# Altium schematic sheet SCH_BBQ20_USB_Keyboard.schdoc
size 432 x 302 mm
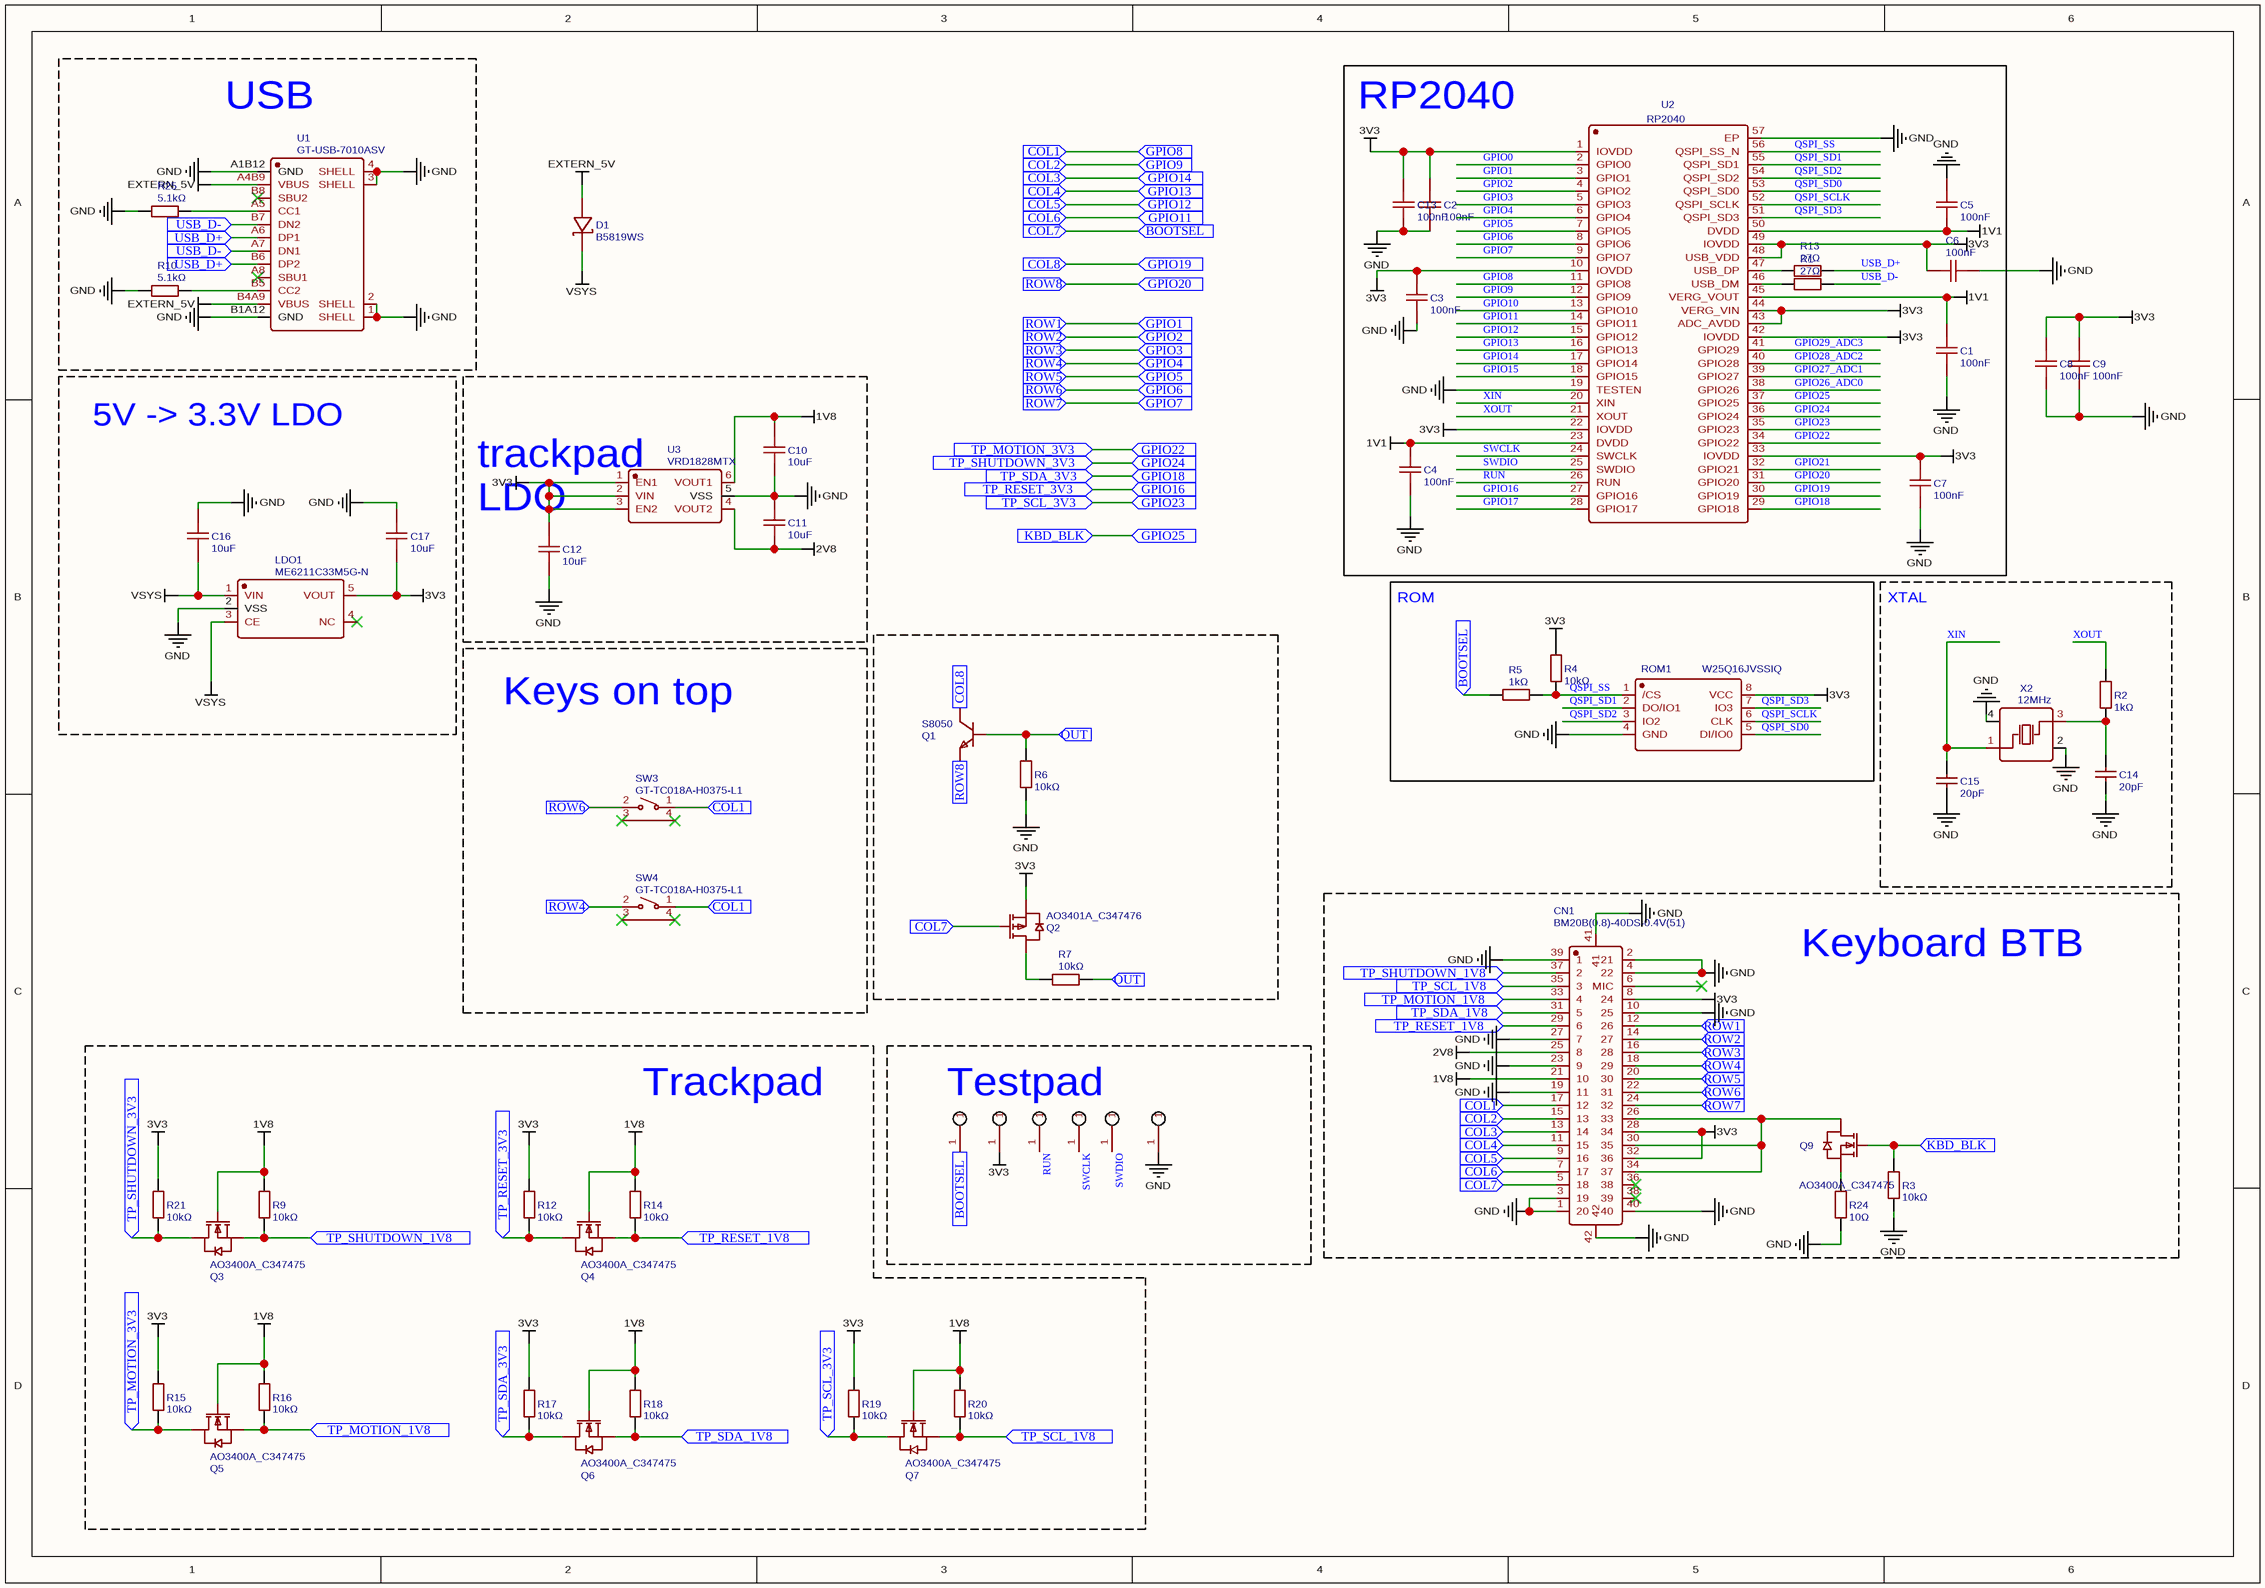
[diagram p0: SCH_BBQ20_USB_Keyboard.schdoc]

## Parts
C1  100nF  [C0603]
C2  100nF  [C0603]
C3  100nF  [C0603]
C4  100nF  [C0603]
C5  100nF  [C0603]
C6  100nF  [C0603]
C7  100nF  [C0603]
C8  100nF  [C0603]
C9  100nF  [C0603]
C10  10uF  [C0603]
C11  10uF  [C0603]
C12  10uF  [C0603]
C13  100nF  [C0603]
C14  20pF  [C0603]
C15  20pF  [C0603]
C16  10uF  [C0603]
C17  10uF  [C0603]
CN1  BM20B(0.8)-40DS-0.4V(51)  [CONN-SMD_BM20B-0.8-40DS-0.4V-51]
D1  B5819WS  [SOD-323_L1.8-W1.3-LS2.5-RD]
LDO1  ME6211C33M5G-N  [SOT-23-5_L3.0-W1.7-P0.95-LS2.8-BL]
Q1  S8050  [SOT-23-3_L2.9-W1.3-P1.90-LS2.4-BR]
Q2  AO3401A_C347476  [SOT-23_L2.9-W1.3-P1.90-LS2.4-BR]
Q3  AO3400A_C347475  [SOT-23-3_L2.9-W1.3-P1.90-LS2.4-BR]
Q4  AO3400A_C347475  [SOT-23-3_L2.9-W1.3-P1.90-LS2.4-BR]
Q5  AO3400A_C347475  [SOT-23-3_L2.9-W1.3-P1.90-LS2.4-BR]
Q6  AO3400A_C347475  [SOT-23-3_L2.9-W1.3-P1.90-LS2.4-BR]
Q7  AO3400A_C347475  [SOT-23-3_L2.9-W1.3-P1.90-LS2.4-BR]
Q9  AO3400A_C347475  [SOT-23-3_L2.9-W1.3-P1.90-LS2.4-BR]
R1  27Ω  [R0603]
R2  1kΩ  [R0603]
R3  10kΩ  [R0603]
R4  10kΩ  [R0603]
R5  1kΩ  [R0603]
R6  10kΩ  [R0603]
R7  10kΩ  [R0603]
R9  10kΩ  [R0603]
R10  5.1kΩ  [R0603]
R12  10kΩ  [R0603]
R13  27Ω  [R0603]
R14  10kΩ  [R0603]
R15  10kΩ  [R0603]
R16  10kΩ  [R0603]
R17  10kΩ  [R0603]
R18  10kΩ  [R0603]
R19  10kΩ  [R0603]
R20  10kΩ  [R0603]
R21  10kΩ  [R0603]
R24  10Ω  [R0603]
R25  5.1kΩ  [R0603]
ROM1  W25Q16JVSSIQ  [SOIC-8_L5.3-W5.3-P1.27-LS8.0-BL]
SW3  GT-TC018A-H0375-L1  [SW-SMD_L4.7-W3.5-P3.35-EH]
SW4  GT-TC018A-H0375-L1  [SW-SMD_L4.7-W3.5-P3.35-EH]
U1  GT-USB-7010ASV  [USB-C-SMD_G-SWITCH_GT-USB-7010ASV]
U2  RP2040  [QFN-56_L7.0-W7.0-P0.90-TL-EP3.2]
U3  VRD1828MTX  [SOT-23-6_L2.9-W1.6-P0.95-LS2.8-BL]
U5  NO  [测试焊盘]  (value not drawn)
U6  NO  [测试焊盘]  (value not drawn)
U7  NO  [测试焊盘]  (value not drawn)
U8  NO  [测试焊盘]  (value not drawn)
U9  NO  [测试焊盘]  (value not drawn)
U10  NO  [测试焊盘]  (value not drawn)
X2  12MHz  [CRYSTAL-SMD_4P-L3.2-W2.5-BL]

## Blocks framed on the sheet
USB: R10 R25 U1
RP2040: C1-C7 C13 R1 R13 U2
5V -> 3.3V LDO: C16 C17 LDO1
ROM: R4 R5 ROM1
XTAL: C14 C15 R2 X2
Keys on top: SW3 SW4
Keyboard BTB: CN1 Q9 R3 R24
Trackpad: Q3-Q7 R9 R12 R14-R21
Testpad: U5-U10

## Ports
BOOTSEL (in), COL1 (in), COL2 (in), COL3 (in), COL4 (in), COL5 (in), COL6 (in), COL7 (in), COL8 (in), GPIO1 (in), GPIO2 (in), GPIO3 (in), GPIO4 (in), GPIO5 (in), GPIO6 (in), GPIO7 (in), GPIO8 (in), GPIO9 (in), GPIO11 (in), GPIO12 (in), GPIO13 (in), GPIO14 (in), GPIO16 (in), GPIO18 (in), GPIO19 (in), GPIO20 (in), GPIO22 (in), GPIO23 (in), GPIO24 (in), GPIO25 (in), KBD_BLK (in), OUT (in), ROW1 (in), ROW2 (in), ROW3 (in), ROW4 (in), ROW5 (in), ROW6 (in), ROW7 (in), ROW8 (in), TP_MOTION_1V8 (in), TP_MOTION_3V3 (in), TP_RESET_1V8 (in), TP_RESET_3V3 (in), TP_SCL_1V8 (in), TP_SCL_3V3 (in), TP_SDA_1V8 (in), TP_SDA_3V3 (in), TP_SHUTDOWN_1V8 (in), TP_SHUTDOWN_3V3 (in), USB_D+ (in), USB_D- (in)

## Nets
1V1: C1.2 C4.2 C5.1 U2.23(DVDD) U2.45(VERG_VOUT) U2.50(DVDD)
1V8: C10.2 CN1.21(10) Q3.1(G) Q4.1(G) Q5.1(G) Q6.1(G) Q7.1(G) R9.2 R14.2 R16.2 R18.2 R20.2 U3.6(VOUT1)
2V8: C11.1 CN1.25(8) U3.4(VOUT2)
3V3: C2.2 C3.2 C6.2 C7.2 C8.2 C9.2 C12.2 C13.2 C17.1 CN1.8(24) CN1.28(34) CN1.32(36) LDO1.5(VOUT) Q2.2(S) R4.2 R12.2 R15.2 R17.2 R19.2 R21.2 ROM1.8(VCC) U2.1(IOVDD) U2.10(IOVDD) U2.22(IOVDD) U2.33(IOVDD) U2.42(IOVDD) U2.43(ADC_AVDD) U2.44(VERG_VIN) U2.48(USB_VDD) U2.49(IOVDD) U3.1(EN1) U3.2(VIN) U3.3(EN2) U6.1
EXTERN_5V: D1.2(A) U1.A4B9(VBUS) U1.B4A9(VBUS)
GND: C1.1 C2.1 C3.1 C4.1 C5.2 C6.1 C7.1 C8.1 C9.1 C10.1 C11.2 C12.1 C13.1 C14.1 C15.1 C16.2 C17.2 CN1.1(20) CN1.2(21) CN1.3(19) CN1.4(22) CN1.10(25) CN1.19(11) CN1.23(9) CN1.27(7) CN1.39(1) CN1.40 CN1.41 CN1.42 LDO1.2(VSS) R3.1 R6.1 R10.1 R24.1 R25.1 ROM1.4(GND) U1.1(SHELL) U1.2(SHELL) U1.3(SHELL) U1.4(SHELL) U1.A1B12(GND) U1.B1A12(GND) U2.19(TESTEN) U2.57(EP) U3.5(VSS) U10.1 X2.2(GND) X2.4(GND)
VSYS: C16.1 D1.1(K) LDO1.1(VIN) LDO1.3(CE)
BOOTSEL: CN1.5(18) Q2.1(G) R5.2 U5.1 ; port COL7, port BOOTSEL
COL1: CN1.17(12) SW3.1 SW4.1 ; port COL1, port GPIO8
COL2: CN1.15(13) ; port COL2, port GPIO9
COL3: CN1.13(14) ; port COL3, port GPIO14
COL4: CN1.11(15) ; port COL4, port GPIO13
COL5: CN1.9(16) ; port COL5, port GPIO12
COL6: CN1.7(17) ; port COL6, port GPIO11
COL8: Q1.3(C) ; port COL8, port GPIO19
GPIO0: U2.2(GPIO0)
GPIO1: CN1.12(26) ; port ROW1, port GPIO1
GPIO1: U2.3(GPIO1)  [a separate net that carries the same name]
GPIO2: CN1.14(27) ; port ROW2, port GPIO2
GPIO2: U2.4(GPIO2)  [a separate net that carries the same name]
GPIO3: CN1.16(28) ; port ROW3, port GPIO3
GPIO3: U2.5(GPIO3)  [a separate net that carries the same name]
GPIO4: CN1.18(29) SW4.2 ; port ROW4, port GPIO4
GPIO4: U2.6(GPIO4)  [a separate net that carries the same name]
GPIO5: CN1.20(30) ; port ROW5, port GPIO5
GPIO5: U2.7(GPIO5)  [a separate net that carries the same name]
GPIO6: CN1.22(31) SW3.2 ; port ROW6, port GPIO6
GPIO6: U2.8(GPIO6)  [a separate net that carries the same name]
GPIO7: CN1.24(32) ; port ROW7, port GPIO7
GPIO7: U2.9(GPIO7)  [a separate net that carries the same name]
GPIO8: U2.11(GPIO8)
GPIO9: U2.12(GPIO9)
GPIO10: U2.13(GPIO10)
GPIO11: U2.14(GPIO11)
GPIO12: U2.15(GPIO12)
GPIO13: U2.16(GPIO13)
GPIO14: U2.17(GPIO14)
GPIO15: U2.18(GPIO15)
GPIO16: U2.27(GPIO16)
GPIO16: Q4.3(D) R12.1 ; port GPIO16, port TP_RESET_3V3  [a separate net that carries the same name]
GPIO17: U2.28(GPIO17)
GPIO18: U2.29(GPIO18)
GPIO18: Q6.3(D) R17.1 ; port GPIO18, port TP_SDA_3V3  [a separate net that carries the same name]
GPIO19: U2.30(GPIO19)
GPIO20: U2.31(GPIO20)
GPIO20: Q1.2(E) ; port ROW8, port GPIO20  [a separate net that carries the same name]
GPIO21: U2.32(GPIO21)
GPIO22: U2.34(GPIO22)
GPIO22: Q5.3(D) R15.1 ; port GPIO22, port TP_MOTION_3V3  [a separate net that carries the same name]
GPIO23: U2.35(GPIO23)
GPIO23: Q7.3(D) R19.1 ; port GPIO23, port TP_SCL_3V3  [a separate net that carries the same name]
GPIO24: U2.36(GPIO24)
GPIO24: Q3.3(D) R21.1 ; port GPIO24, port TP_SHUTDOWN_3V3  [a separate net that carries the same name]
GPIO25: U2.37(GPIO25)
GPIO25: Q9.1(G) R3.2 ; port KBD_BLK, port GPIO25  [a separate net that carries the same name]
GPIO26_ADC0: U2.38(GPIO26)
GPIO27_ADC1: U2.39(GPIO27)
GPIO28_ADC2: U2.40(GPIO28)
GPIO29_ADC3: U2.41(GPIO29)
OUT: Q1.1(B) R6.2 R7.2 ; port OUT
QSPI_SCLK: ROM1.6(CLK) U2.52(QSPI_SCLK)
QSPI_SD0: ROM1.5(DI/IO0) U2.53(QSPI_SD0)
QSPI_SD1: ROM1.2(DO/IO1) U2.55(QSPI_SD1)
QSPI_SD2: ROM1.3(IO2) U2.54(QSPI_SD2)
QSPI_SD3: ROM1.7(IO3) U2.51(QSPI_SD3)
QSPI_SS: R4.1 R5.1 ROM1.1(/CS) U2.56(QSPI_SS_N)
RUN: U2.26(RUN) U7.1
SWCLK: U2.24(SWCLK) U8.1
SWDIO: U2.25(SWDIO) U9.1
TP_MOTION_1V8: CN1.33(4) Q5.2(S) R16.1 ; port TP_MOTION_1V8
TP_RESET_1V8: CN1.29(6) Q4.2(S) R14.1 ; port TP_RESET_1V8
TP_SCL_1V8: CN1.35(3) Q7.2(S) R20.1 ; port TP_SCL_1V8
TP_SDA_1V8: CN1.31(5) Q6.2(S) R18.1 ; port TP_SDA_1V8
TP_SHUTDOWN_1V8: CN1.37(2) Q3.2(S) R9.1 ; port TP_SHUTDOWN_1V8
USB_D+: U1.A6(DP1) U1.B6(DP2) ; port USB_D+
USB_D+: R13.2  [a separate net that carries the same name]
USB_D-: U1.A7(DN1) U1.B7(DN2) ; port USB_D-
USB_D-: R1.2  [a separate net that carries the same name]
XIN: C15.2 U2.20(XIN) X2.1(OSC1)
XOUT: R2.2 U2.21(XOUT)
NetC14_2: C14.2 R2.1 X2.3(OSC2)
NetCN1_26: CN1.26(33) CN1.30(35) CN1.34(37) Q9.3(D)
NetQ2_3: Q2.3(D) R7.1
NetQ9_2: Q9.2(S) R24.2
NetR1_1: R1.1 U2.46(USB_DM)
NetR10_2: R10.2 U1.B5(CC2)
NetR13_1: R13.1 U2.47(USB_DP)
NetR25_2: R25.2 U1.A5(CC1)

Not connected (* = marked no-connect by the designer): CN1 6(MIC)* 36(38)* 38(39)*; LDO1 4(NC)*; SW3 3* 4*; SW4 3* 4*; U1 A8(SBU1)* B8(SBU2)*

## Notes on the sheet
- (near C12) trackpad
  LDO

## Library data of the parts
C1-C9 C13 = 100nF: Manufacturer: YAGEO(国巨); Manufacturer Part: CC0603KRX7R9BB104; nameAlias: Value; Supplier: LCSC; Supplier Part: C14663; JLCPCB Part Class: Basic Part; link: https://so.szlcsc.com/global.html?k=C14663&ref=editor; spicePre: C; spiceSymbolName: CC0603KRX7R9BB104
C10-C12 C16 C17 = 10uF: Manufacturer: SAMSUNG(三星); Manufacturer Part: CL10A106KP8NNNC; nameAlias: Value; Supplier: LCSC; Supplier Part: C19702; JLCPCB Part Class: Basic Part; link: https://so.szlcsc.com/global.html?k=C19702&ref=editor; spicePre: C; spiceSymbolName: CL10A106KP8NNNC
C14 C15 = 20pF: Manufacturer: YAGEO(国巨); Manufacturer Part: CC0603JRNPO9BN200; nameAlias: Value; Supplier: LCSC; Supplier Part: C105621; JLCPCB Part Class: Extended Part; link: https://so.szlcsc.com/global.html?k=C105621&ref=editor; spicePre: C; spiceSymbolName: CC0603JRNPO9BN200
CN1 = BM20B(0.8)-40DS-0.4V(51): Manufacturer: HRS(广濑); Contributor: LCSC; Supplier: LCSC; Supplier Part: C424543; Manufacturer Part: BM20B(0.8)-40DS-0.4V(51); JLCPCB Part Class: Extended Part; spicePre: C; spiceSymbolName: BM20B(0.8)-40DS-0.4V(51)
D1 = B5819WS: Manufacturer: MDD; Supplier: LCSC; Manufacturer Part: B5819WS; Supplier Part: C64886; JLCPCB Part Class: Extended Part; link: https://so.szlcsc.com/global.html?k=C64886&ref=editor; spicePre: D; spiceSymbolName: B5819WS
LDO1 = ME6211C33M5G-N: Manufacturer: MICRONE(南京微盟); Supplier: LCSC; Manufacturer Part: ME6211C33M5G-N; Supplier Part: C82942; JLCPCB Part Class: Extended Part; link: https://so.szlcsc.com/global.html?k=C82942&ref=editor; spicePre: L; spiceSymbolName: ME6211C33M5G-N
Q1 = S8050: Manufacturer: JSMSEMI; Contributor: LCSC; Supplier: LCSC; Supplier Part: C916390; Manufacturer Part: S8050; JLCPCB Part Class: Extended Part; spicePre: Q; spiceSymbolName: S8050
Q2 = AO3401A_C347476: Manufacturer: UMW(广东友台半导体); Contributor: LCSC; Supplier: LCSC; Supplier Part: C347476; Manufacturer Part: AO3401A; JLCPCB Part Class: Extended Part; link: https://so.szlcsc.com/global.html?k=C347476&ref=editor; spicePre: Q; spiceSymbolName: AO3401A_C347476
Q3-Q7 Q9 = AO3400A_C347475: Manufacturer: UMW(广东友台半导体); Contributor: LCSC; Supplier: LCSC; Supplier Part: C347475; Manufacturer Part: AO3400A; JLCPCB Part Class: Extended Part; link: https://so.szlcsc.com/global.html?k=C347475&ref=editor; spicePre: Q; spiceSymbolName: AO3400A_C347475
R1 R13 = 27Ω: Manufacturer: UNI-ROYAL(厚声); Manufacturer Part: 0603WAF270JT5E; nameAlias: Value; Supplier: LCSC; Supplier Part: C25190; JLCPCB Part Class: Basic Part; link: https://so.szlcsc.com/global.html?k=C25190&ref=editor; spicePre: R; spiceSymbolName: 0603WAF270JT5E
R2 R5 = 1kΩ: Manufacturer: UNI-ROYAL(厚声); Manufacturer Part: 0603WAF1001T5E; nameAlias: Value; Supplier: LCSC; Supplier Part: C21190; JLCPCB Part Class: Basic Part; link: https://so.szlcsc.com/global.html?k=C21190&ref=editor; spicePre: R; spiceSymbolName: 0603WAF1001T5E
R3 R4 R6 R7 R9 R12 R14-R21 = 10kΩ: Manufacturer: UNI-ROYAL(厚声); Manufacturer Part: 0603WAF1002T5E; nameAlias: Value; Supplier: LCSC; Supplier Part: C25804; JLCPCB Part Class: Basic Part; link: https://so.szlcsc.com/global.html?k=C25804&ref=editor; spicePre: R; spiceSymbolName: 0603WAF1002T5E
R10 R25 = 5.1kΩ: Manufacturer Part: 0603WAF5101T5E; Manufacturer: UNI-ROYAL(厚声); nameAlias: Value; Supplier: LCSC; Supplier Part: C23186; JLCPCB Part Class: Basic Part; link: https://so.szlcsc.com/global.html?k=C23186&ref=editor; spicePre: R; spiceSymbolName: 0603WAF5101T5E
R24 = 10Ω: Manufacturer: UNI-ROYAL(厚声); Manufacturer Part: 0603WAF100JT5E; nameAlias: Value; Supplier: LCSC; Supplier Part: C22859; JLCPCB Part Class: Basic Part; link: https://so.szlcsc.com/global.html?k=C22859&ref=editor; spicePre: R; spiceSymbolName: 0603WAF100JT5E
ROM1 = W25Q16JVSSIQ: Manufacturer: WINBOND; Supplier: LCSC; Manufacturer Part: W25Q16JVSSIQ; Supplier Part: C82317; JLCPCB Part Class: Extended Part; spicePre: U; spiceSymbolName: W25Q16JVSSIQ
SW3 SW4 = GT-TC018A-H0375-L1: Manufacturer: G-Switch(品赞); Contributor: LCSC; Supplier: LCSC; Supplier Part: C963235; Manufacturer Part: GT-TC018A-H0375-L1; JLCPCB Part Class: Extended Part; link: https://so.szlcsc.com/global.html?k=C963235&ref=editor; spicePre: S; spiceSymbolName: GT-TC018A-H0375-L1
U1 = GT-USB-7010ASV: Manufacturer: G-Switch(品赞); Contributor: lcsc; Supplier: LCSC; Supplier Part: C2988369; Manufacturer Part: GT-USB-7010ASV; JLCPCB Part Class: Extended Part; link: https://so.szlcsc.com/global.html?k=C2988369&ref=editor; spicePre: U; spiceSymbolName: GT-USB-7010ASV
U2 = RP2040: Manufacturer: Raspberry Silicon; Manufacturer Part: MC34VR500V4ES; Contributor: rqnce; Supplier: RS-Online; link: https://datasheets.raspberrypi.org/rp2040/rp2040-datasheet.pdf; spicePre: U; spiceSymbolName: RP2040
U3 = VRD1828MTX: Manufacturer: AnaSem; Contributor: LCSC; Supplier: LCSC; Supplier Part: C697923; Manufacturer Part: VRD1828MTX; JLCPCB Part Class: Extended Part; spicePre: U; spiceSymbolName: VRD1828MTX
U5-U10 = NO: Contributor: CHENHUIJIE; spicePre: T; spiceSymbolName: 测试焊盘
X2 = 12MHz: Manufacturer: TAE(雅晶鑫); Manufacturer Part: TAXM12M4RLBDDT2T; nameAlias: Value; Contributor: LCSC; Supplier: LCSC; Supplier Part: C133334; JLCPCB Part Class: Extended Part; link: https://so.szlcsc.com/global.html?k=C133334&ref=editor; spicePre: X; spiceSymbolName: SMD-3225_4P12M20PF10PPM